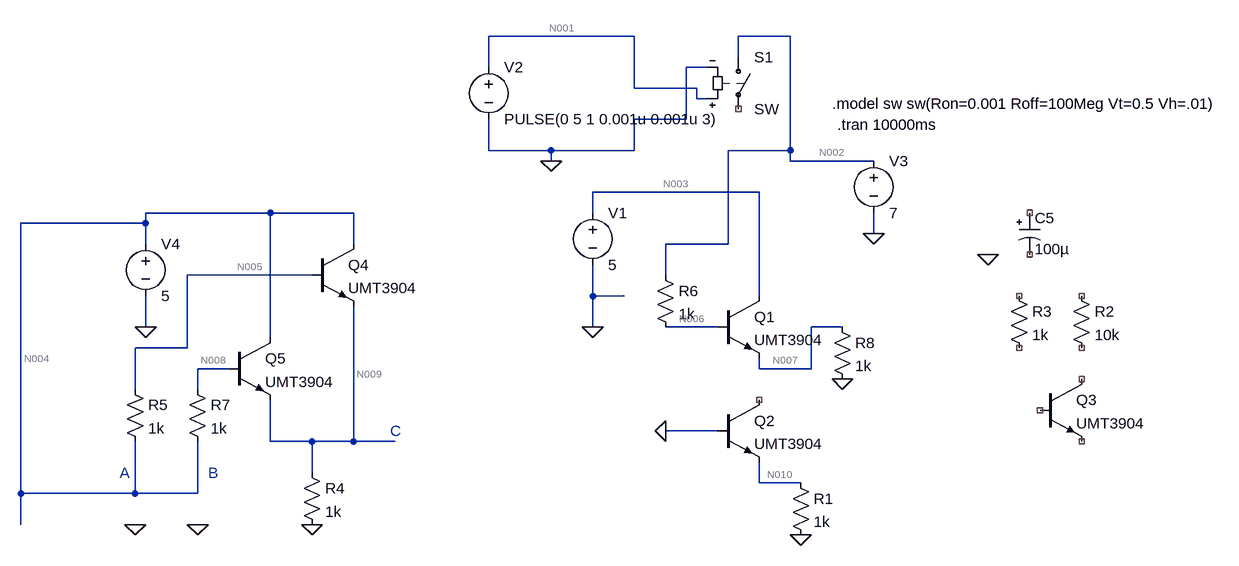
[diagram p0: schematic Capacitors.asc]
* Capacitors.asc
V1 N003 0 5
V2 N001 0 PULSE(0 5 1 0.001u 0.001u 3)
S1 N002 NC_01 N001 0 SW
C5 NC_02 NC_03 100µ V=25 Irms=145m Rser=0.62 Lser=0 mfg="Nichicon" pn="UPR1E101MPH" type="Al electrolytic"
R2 NC_04 NC_05 10k tol=1
R3 NC_06 NC_07 1k tol=1
Q3 NC_08 NC_09 NC_10 0 UMT3904
V3 N002 0 7
Q1 N003 N006 N007 0 UMT3904
Q2 NC_11 0 N010 0 UMT3904
R1 N010 0 1k tol=1
V4 N004 0 5
Q4 N004 N005 N009 0 UMT3904
Q5 N004 N008 N009 0 UMT3904
R4 N009 0 1k tol=1
R6 N002 N006 1k tol=1
R5 N005 N004 1k tol=1
R7 N008 N004 1k tol=1
R8 N007 0 1k tol=1
.model NPN NPN
.model PNP PNP
.lib standard.bjt
.model sw sw(Ron=0.001 Roff=100Meg Vt=0.5 Vh=.01)
.tran 10000ms
* A
* B
* C
.backanno
.end

* Results of the author's LTspice run, read from the files saved beside the schematic
* Operating Point, zero values left out:
*   V(n003) = 5 V
*   V(n002) = 7 V
*   V(n006) = 5.666 V
*   V(n007) = 4.947 V
*   V(n004) = 5 V
*   V(n005) = 4.986 V
*   V(n009) = 4.303 V
*   V(n008) = 4.986 V
*   Ic(Q5) = 2.138 mA
*   Ib(Q5) = 13.57 µA
*   Ie(Q5) = -2.152 mA
*   Ic(Q4) = 2.138 mA
*   Ib(Q4) = 13.57 µA
*   Ie(Q4) = -2.152 mA
*   Ic(Q1) = 3.613 mA
*   Ib(Q1) = 1.334 mA
*   Ie(Q1) = -4.947 mA
*   I(R8) = 4.947 mA
*   I(R7) = -13.57 µA
*   I(R5) = -13.57 µA
*   I(R6) = 1.334 mA
*   I(R4) = 4.303 mA
*   I(V4) = -4.303 mA
*   I(V3) = -1.334 mA
*   I(V1) = -3.613 mA
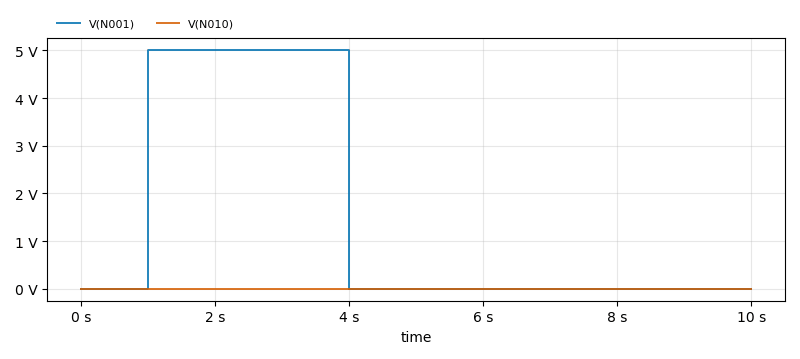
[diagram p1: Transient Analysis of Capacitors.asc, plotted from the saved traces]
* Transient Analysis, 1 run:
*   V(N001): min 0 V, max 5 V, average 1.5 V, rms 2.739 V, last 0 V
*   V(N010): min -1.945e-11 fV, max 8.656e-13 fV, average -3.606e-12 fV, rms 8.666e-12 fV, last -5.524e-17 fV